# EAGLE design powerV2 (EAGLE 7.2.0)
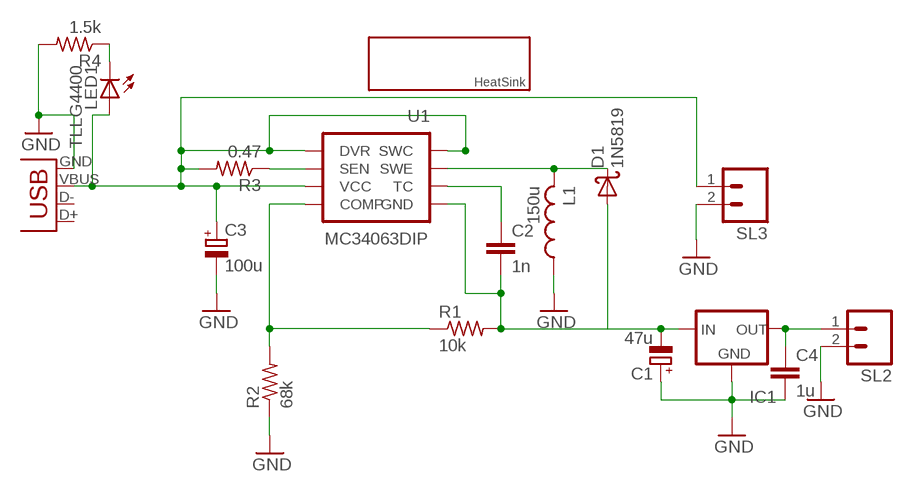
[diagram p0: schematic, sheet 1]

## Parts
C1  47u  CPOL-EUE2.5-7  [E2,5-7]
C2  1n  C-EU025-024X044  [C025-024X044]
C3  100u  CPOL-EUE2.5-7  [E2,5-7]
C4  1u  C-EU025-024X044  [C025-024X044]
D1  1N5819  [DO41-10]
IC1  79XXS  [79XXS]
L1  150u  L-US0204/7  [0204/7]
LED1  TLLG4400  [LED3MM]
R1  10k  R-US_0204/7  [0204/7]
R2  68k  R-US_0204/7  [0204/7]
R3  0.47  R-US_0613/15  [P0613/15]
R4  1.5k  R-US_0204/7  [0204/7]
SL2  M02  [02P]
SL3  M02  [02P]
U1  MC34063DIP  [DIP-08]
U$1  HEATSINKMEDIUM  [HEATSINK-MED]
X1  USBSMD  [USB-MINIB]

## Nets
GND: C1.+ C3.- C4.2 IC1.GND L1.1 R2.1 R4.2 SL2.2 SL3.2 X1.GND
N$1: R3.1 U1.7(SEN)
N$2: C3.+ LED1.A R3.2 SL3.1 U1.1(SWC) U1.6(VCC) U1.8(DVR) X1.VBUS
N$3: C4.1 IC1.OUT SL2.1
N$4: C1.- C2.2 D1.A IC1.IN R1.2 U1.4(GND)
N$5: R1.1 R2.2 U1.5(COMP)
N$6: D1.C L1.2 U1.2(SWE)
N$11: C2.1 U1.3(TC)
N$13: LED1.K(C) R4.1
Unconnected: X1.D+ X1.D-

## Library data of the parts
C1 C3 = rcl:CPOL-EU: POLARIZED CAPACITOR, European symbol
C2 C4 = rcl:C-EU: CAPACITOR, European symbol
D1 = CEDT_September_2014:1N5819: DIODE general purpose rectifier, 1 A
IC1 = v-reg:79XXS: VOLTAGE REGULATOR
L1 = rcl:L-US: INDUCTOR, American symbol
LED1 = led:TLLG4400: Low Current (2mA) LED 3 mm Tinted Diffused Package color GREEN Source: Data sheet <http://www.farnell.com/datasheets/391098.pdf>; MF: VISHAY SEMICONDUCTOR; OC_FARNELL: 1612435
R1-R4 = resistor:R-US_: RESISTOR, American symbol
SL2 SL3 = con-amp-quick:M02: AMP QUICK CONNECTOR; OC_FARNELL: unknown; OC_NEWARK: unknown
U1 = SparkFun-PowerIC:MC34063: Jellybean switching supply controller
U$1 = CEDT_September_2014:HEATSINK
X1 = CEDT_September_2014:USB: USB Connectors USB-B-PTH is fully proven SKU : PRT-00139 USB-miniB is fully proven SKU : PRT-00587 USB-A-PCB is untested. USB-A-H is throughly reviewed, but untested. Spark Fun Electronics SKU : PRT-00437 USB-B-SMT is throughly reviewed, but untested. Needs silkscreen touching up. USB-A-S has not been used/tested USB-MB-H has not been used/tested

## Board
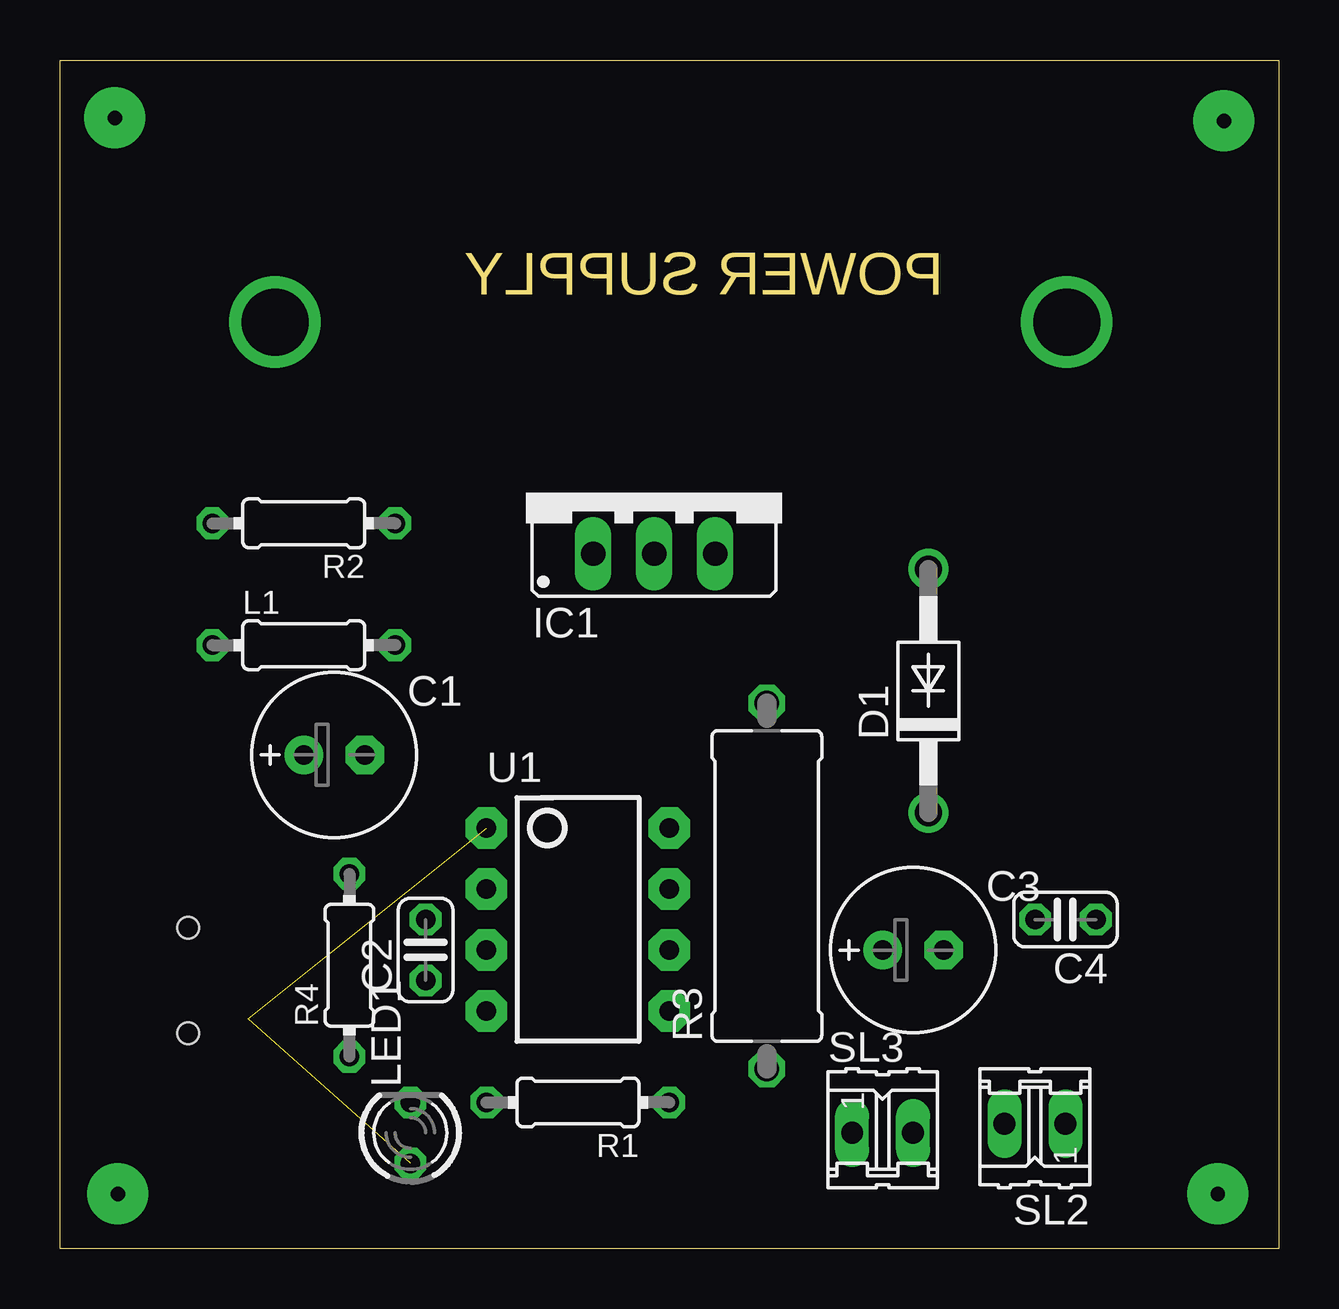
[diagram p1: board, top side]
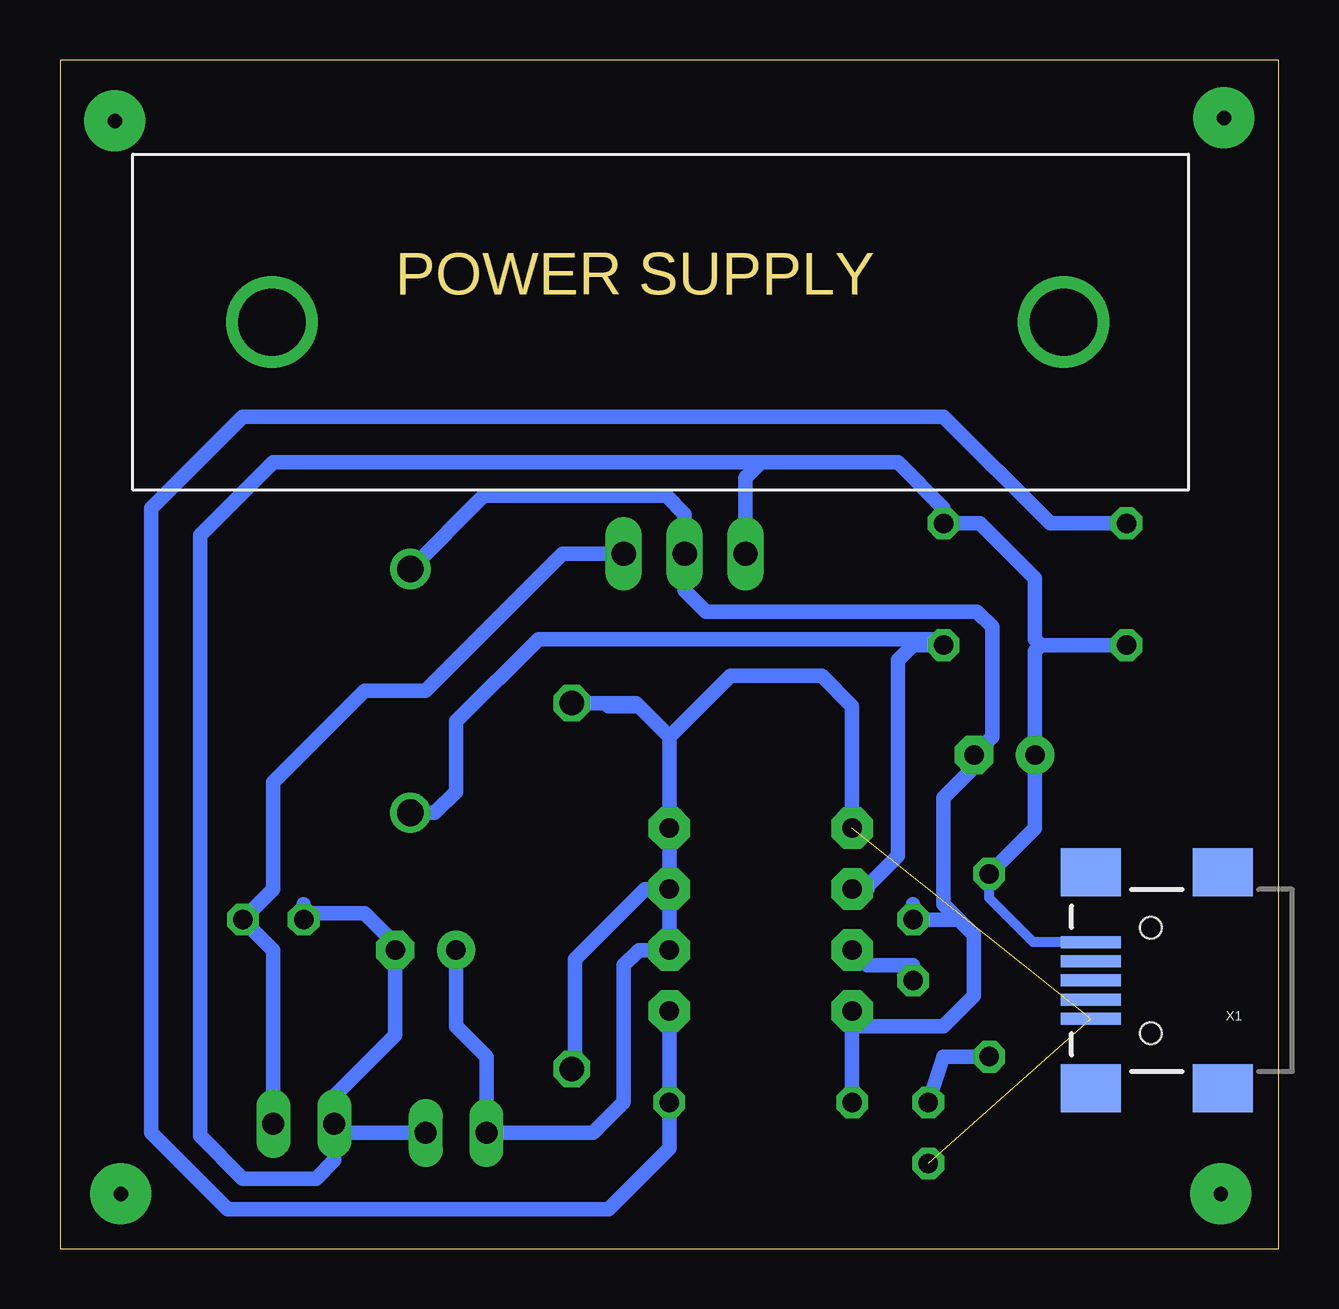
[diagram p2: board, bottom side, seen from below]

Size 50.8 x 49.53 mm. Coordinates in mm from the lower left corner, seen from the top.
Outline: 0,0 0,49.53 50.8,49.53 50.8,0 0,0
Copper layers (1*16): Top 0.035mm / dielectric 1.5mm / Bottom 0.035mm
Design rules "default *": minimum track width 10mil, minimum drill 24mil, track to track 12mil, track to pad 12mil, pad to pad 12mil, via to via 12mil, smd to smd 12mil, copper to edge 40mil, drill to drill 8mil, minimum pad ring 10mil, minimum via ring 8mil, stop-mask expansion 4mil, vias tented up to drill 0mil, thermal gap 10mil

### Footprints (pad centres in the part's own frame; a part is rotated, then mirrored left to right if it is on the bottom)
E2,5-7 = drill 0.813 pad 1.6: + -1.27,0 | drill 0.813 pad 1.6 octagon: - 1.27,0
C025-024X044 = drill 0.813 octagon: 1 -1.27,0; 2 1.27,0
DO41-10 = drill 1.118: A 5.08,0; C -5.08,0
79XXS = drill 1.016 long: GND -2.54,-2.54; IN 0,-2.54; OUT 2.54,-2.54
0204/7 = drill 0.813 octagon: 1 -3.81,0; 2 3.81,0
LED3MM = drill 0.813 octagon: A -1.27,0; K 1.27,0
P0613/15 = drill 1.016 octagon: 1 -7.62,0; 2 7.62,0
02P = drill 0.914 long: 1 -1.27,0; 2 1.27,0
DIP-08 = drill 0.813 pad 1.727 octagon: 1 -3.81,-3.81; 2 -1.27,-3.81; 3 1.27,-3.81; 4 3.81,-3.81; 5 3.81,3.81; 6 1.27,3.81; 7 -1.27,3.81; 8 -3.81,3.81
HEATSINK-MED = drill 2.8 pad 3.81: P$1 -15.8,0; P$2 17.2,0
USB-MINIB = smd 2.5 x 0.5: D+ 2.5,0; D- 2.5,0.8; GND 2.5,-1.6; ID 2.5,-0.8; VBUS 2.5,1.6 | smd 2.5 x 2: GND@1 -3,-4.5; GND@2 -3,4.5; GND@3 2.5,4.5; GND@4 2.5,-4.5 | hole 0.9: 0,2.2; 0,-2.2

### Placement (x,y rotation side)
C1  11.43,20.57 0 top
C2  15.24,12.45 90 top
C3  35.56,12.45 0 top
C4  41.91,13.72 180 top
D1  36.2,23.24 90 top
IC1  24.77,31.5 0 top
L1  10.16,25.15 0 top
LED1  14.61,4.83 90 top
R1  21.59,6.1 180 top
R2  10.16,30.23 180 top
R3  29.46,15.11 90 top
R4  12.06,11.81 90 top
SL2  40.64,5.21 180 top
SL3  34.29,4.83 0 top
U1  21.59,13.72 270 top
U$1  24.77,38.61 0 top
X1  5.33,11.18 180 bottom

### Tracks (layer width: path | path; a pad name or v marks a point on that pad's centre or on a via)
GND
  Bottom 0.406: X1.GND 10.24,12.78 12.06,14.61 R4.2
  Bottom 0.61: 40.64,14.35 C4.2 40.39,13.97 38.1,13.97 36.83,12.7 C3.- 36.83,8.89 39.37,6.35 SL2.2 | SL3.2 38.99,4.83 SL2.2 | R4.2 10.16,17.53 C1.+ 10.16,24.89 9.91,25.15 | 21.59,32.77 15.88,32.77 13.97,30.86 R2.1 12.45,30.23 10.16,27.94 10.16,25.4 9.91,25.15 | 21.59,32.77 41.91,32.77 44.96,29.72 44.96,4.7 43.18,2.92 40.13,2.92 39.37,3.68 SL2.2 | IC1.GND 22.23,32.13 21.59,32.77 | L1.1 9.91,25.15
N$1
  Bottom 0.61: U1.7 26.42,14.99 29.34,12.06 29.34,7.62 R3.1
N$2  (2 unrouted)
  Bottom 0.61: U1.1 17.78,22.61 19.05,23.88 22.86,23.88 25.4,21.34 | C3.+ 34.29,9.27 33.02,8 SL3.1 28.57,4.83 27.3,6.1 27.3,11.81 26.67,12.45 U1.6 U1.8 25.4,21.34 | 27.94,22.61 26.67,22.61 | 26.67,22.61 25.4,21.34 | R3.2 26.8,22.73 26.67,22.61
N$3
  Bottom 0.61: SL2.1 41.91,12.45 C4.1 41.91,14.99 41.91,19.43 38.1,23.24 35.56,23.24 29.84,28.96 IC1.OUT
N$4
  Bottom 0.61: R1.2 17.78,9.27 | 17.78,9.27 U1.4 | D1.A 33.15,31.37 25.53,31.37 24.77,30.61 IC1.IN 24.77,27.43 23.88,26.54 12.57,26.54 11.94,25.91 11.94,21.34 C1.- 12.7,20.07 13.97,18.8 13.97,14.35 13.34,13.72 | 15.24,14.35 C2.2 13.34,13.72 | 13.34,13.72 13.14,13.53 12.7,13.08 12.7,10.54 13.97,9.27 17.78,9.27
N$5
  Bottom 0.61: U1.5 R1.1 25.4,4.19 27.94,1.65 43.81,1.65 46.99,4.83 46.99,30.86 43.18,34.67 13.97,34.67 9.53,30.23 R2.2
N$6
  Bottom 0.61: U1.2 17.14,14.99 17.14,15.11 15.88,16.38 15.88,24.51 15.24,25.15 L1.2 14.22,25.4 30.86,25.4 34.29,21.97 34.29,19.05 35.18,18.16 D1.C
N$8  (via drill 0.6 pad 2.54)
  other vias: 2.29,47.12
N$9  (via drill 0.6 pad 2.54)
  other vias: 2.41,2.29
N$10  (via drill 0.6 pad 2.54)
  other vias: 48.51,46.99
N$11
  Bottom 0.61: C2.1 15.24,11.81 17.14,11.81 U1.3
N$12  (via drill 0.6 pad 2.54)
  other vias: 48.26,2.29
N$13
  Bottom 0.61: R4.1 13.97,8 LED1.K

### Text on the board
Dimension: POWER SUPPLY